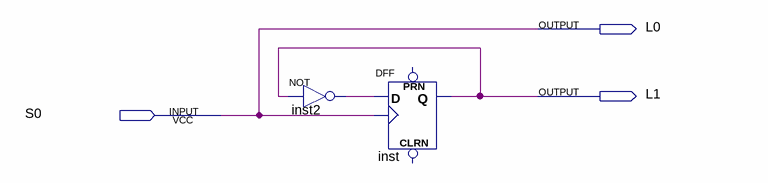
[diagram p0: schematic sheet]
// Quartus schematic exercise1.bdf as structural Verilog: 2 symbols, 3 pins
module exercise1 (
  input  S0,
  output L0,
  output L1
);

  wire inst2_out;

  not inst2 (inst2_out, L1);
  DFF inst (.CLK(S0), .D(inst2_out), .Q(L1));  // open: CLRN, PRN

  assign L0 = S0;
endmodule
